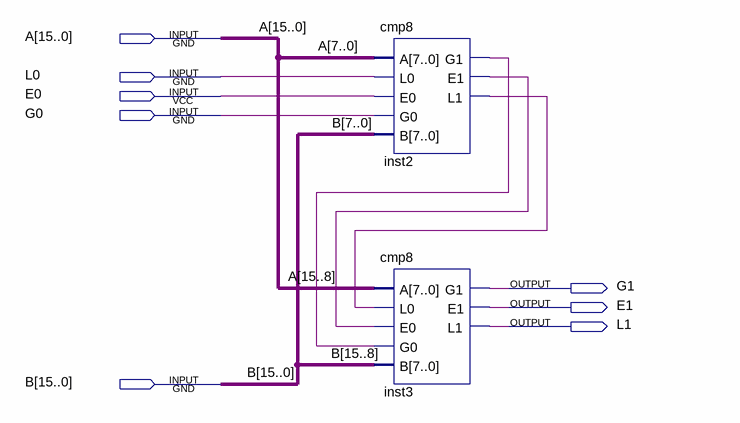
[diagram p0: schematic sheet]
// Quartus schematic cmp16.bdf as structural Verilog: 2 symbols, 8 pins
module cmp16 (
  input  [15:0] A,
  input  L0,
  input  E0,
  input  G0,
  input  [15:0] B,
  output G1,
  output E1,
  output L1
);

  wire inst2_e1, inst2_g1, inst2_l1;

  cmp8 inst2 (.A(A[7:0]), .L0(L0), .E0(E0), .G0(G0), .B(B[7:0]), .G1(inst2_g1), .E1(inst2_e1), .L1(inst2_l1));
  cmp8 inst3 (.A(A[15:8]), .L0(inst2_l1), .E0(inst2_e1), .G0(inst2_g1), .B(B[15:8]), .G1(G1), .E1(E1), .L1(L1));
endmodule
